# Altium schematic sheet LT3094.SchDoc: Almazny
size 420 x 297 mm; CompanyName: WUT; DrawnBy: S.Hanasz; Organization: WUT ISE; Address1: Warsaw Univeristy of Technology; Address2: Nowowiejska 15/19; SheetNumber: 4; SheetTotal: 4; EDA_Number: ARTIQ; Projet: ARTIQ/SINARA; ModifiedBy: -; CreateDate: 15.10.2020; CheckedDate: -; Title2: LT3094 negative LDO; DivGrp: ISE; Designer: S.Hanasz; ModifiedDate: -; ProjectName: ARTIQ/SINARA
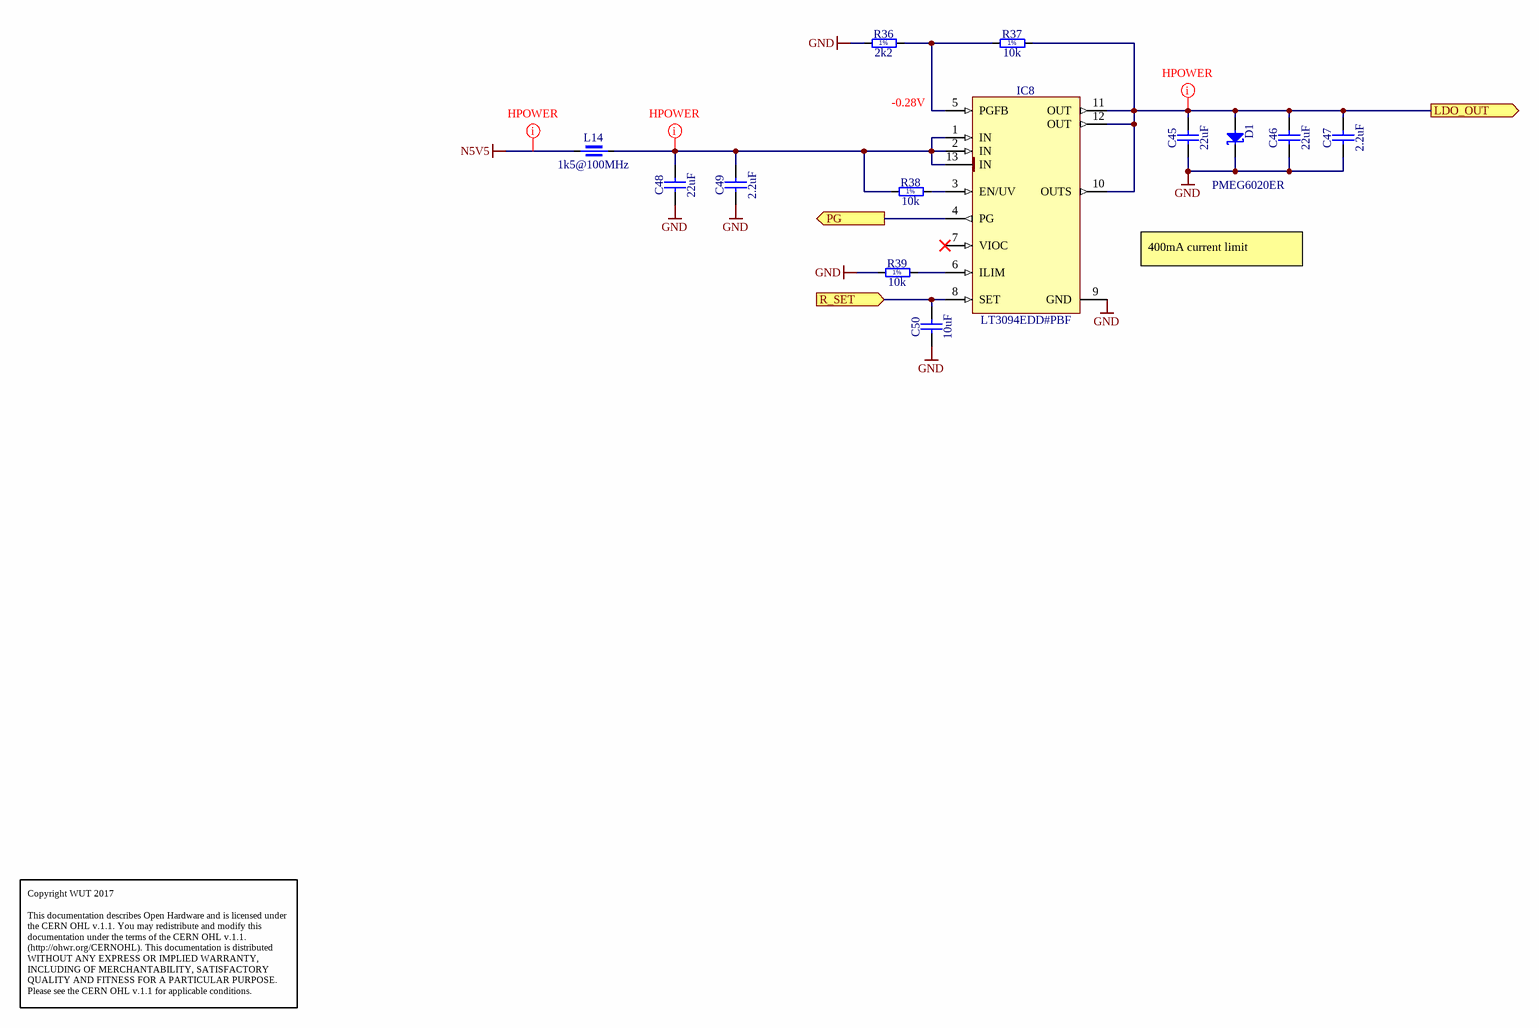
[diagram p0: LT3094.SchDoc]

## Parts
C45  22uF  [CAPC3225X140N]
C46  22uF  [CAPC3225X140N]
C47  2.2uF  [CAPC1608X87N]
C48  22uF  [CAPC3225X140N]
C49  2.2uF  [CAPC1608X87N]
C50  10uF  [CAPC2012X135N]
D1  PMEG6020ER  [SODFL3517X110N]
IC8  LT3094EDD#PBF  [SON45P300X300X80-13N-R175X248]
L14  1k5@100MHz  [INDC2012X110N]
R36  2k2  [RESC1005X40N]
R37  10k  [RESC1005X40N]
R38  10k  [RESC1005X40N]
R39  10k  [RESC1005X40N]

## Ports
LDO_OUT (out), PG (out), R_SET (in)

## Nets
GND: C45.1 C46.1 C47.1 C48.1 C49.1 C50.1 D1.1(C) IC8.9(GND) R36.1 R39.1
N5V5: L14.1
LDO_OUT: C45.2 C46.2 C47.2 D1.2(A) IC8.10(OUTS) IC8.11(OUT) IC8.12(OUT) R37.2 ; port LDO_OUT
PG: IC8.4(PG) ; port PG
R_SET: C50.2 IC8.8(SET) ; port R_SET
NetC48_2: C48.2 C49.2 IC8.1(IN) IC8.2(IN) IC8.13(IN) L14.2 R38.1
NetIC8_3: IC8.3(EN/UV) R38.2
NetIC8_5: IC8.5(PGFB) R36.2 R37.1
NetIC8_6: IC8.6(ILIM) R39.2

Not connected (* = marked no-connect by the designer): IC8 7(VIOC)*

## Layout directives
net class Hpower: LDO_OUT, N5V5, NetC48_2

## Notes on the sheet
- -0.28V
- 400mA current limit
- Copyright WUT 2017
  This documentation describes Open Hardware and is licensed under the CERN OHL v.1.1. You may redistribute and modify this documentation under the terms of the CERN OHL v.1.1. (http://ohwr.org/CERNOHL). This documentation is distributed WITHOUT ANY EXPRESS OR IMPLIED WARRANTY, INCLUDING OF MERCHANTABILITY, SATISFACTORY QUALITY AND FITNESS FOR A PARTICULAR PURPOSE. Please see the CERN OHL v.1.1 for applicable conditions.
- Project/Equipment
- Document
- Designer
- Drawn by
- Check.by
- File
- Last Mod.
- Print Date
- Sheet
- Size
- A3
- of
- Rev
- (in symbol R0402_2K2_1%_0.0625W_100PPM) 1%
- (in symbol R0402_10k_1%_0.0625W_100PPM) 1%
- (in symbol R0402_10K_1%_0.0625W_100PPM) 1%

## Library data of the parts
C45 C46 C48 = CC1210_22UF_25V_20%_X7R: Non-polarised capacitor; Part Description: SMD Multilayer Chip Ceramic Capacitor; Manufacturer: GENERIC; Manufacturer1 Part Number: C1210C226M3RACTU; Voltage: 25V; TC: X7R; Tolerance: ±20%; Part Number: CC1210_22UF_25V_20%_X7R; Component Kind: Standard; Component Type: Standard; Pin Count: 2; Value: 22uF; Status: None; Manufacturer Part Number: CC1210_22UF_25V_20%_X7R; Case: 1210; Mounted: Yes; Socket: No; SMD: Yes; Sense: No; Manufacturer1 Example: KEMET; Manufacturer1 ComponentHeight: 1.4mm; HelpURL: \\cern.ch\dfs\Applications\Altium\Datasheets\CC1210_X7R_KEMET.pdf; Author: CERN DEM JLC; CreateDate: 20.02.2018; LatestRevisionDate: 20.02.2018
C47 C49 = CC0603_2.2UF_16V_10%_X5R: Non-polarised capacitor; Part Description: SMD Multilayer Chip Ceramic Capacitor; Manufacturer: GENERIC; Manufacturer1 Part Number: CC0603KRX5R7BB225; Voltage: 16V; TC: X5R; Tolerance: ±10%; Part Number: CC0603_2.2UF_16V_10%_X5R; Component Kind: Standard; Component Type: Standard; Pin Count: 2; Value: 2.2uF; Status: Preferred; Manufacturer Part Number: CC0603_2.2UF_16V_10%_X5R; Case: 0603; Mounted: Yes; Socket: No; SMD: Yes; Sense: No; Manufacturer1 Example: YAGEO; Manufacturer1 ComponentHeight: 0.9mm; HelpURL: \\cern.ch\dfs\Applications\Altium\Datasheets\CC0805_X5R_PHYCOMP_HC.pdf; Author: CERN DEM JLC; CreateDate: 28.04.2011; LatestRevisionDate: 28.04.2011
C50 = CC0805_10UF_10V_10%_X7R: Non-polarised capacitor; Part Description: SMD Multilayer Chip Ceramic Capacitor; Manufacturer: GENERIC; Manufacturer1 Part Number: GRM21BR71A106KE51L; Voltage: 10V; TC: X7R; Tolerance: ±10%; Part Number: CC0805_10UF_10V_10%_X7R; Component Kind: Standard; Component Type: Standard; Pin Count: 2; Value: 10uF; Status: Preferred; Manufacturer Part Number: CC0805_10UF_10V_10%_X7R; Case: 0805; Mounted: Yes; Socket: No; SMD: Yes; Sense: No; Manufacturer1 Example: MURATA; Manufacturer1 ComponentHeight: 1.35mm; HelpURL: \\cern.ch\dfs\Applications\Altium\Datasheets\CC0805_X7R_MURATA.pdf; Author: CERN DEM JLC; CreateDate: 30.04.2012; LatestRevisionDate: 30.04.2012
D1 = PMEG6020ER: Schottky Diode; Part Description: MEGA Schottky Barrier Rectifier; Manufacturer: NXP SEMICONDUCTORS; Voltage: 60V; Power: 2A; PressFit: No; Bonding: No; Part Number: PMEG6020ER; Component Kind: Standard; Component Type: Standard; Device: PMEG6020ER; PackageDescription: SODFL Diode (SOD123W); 2.60mm W X 1.70mm L X 1.10mm H body, IPC Medium Density; Manufacturer Part Number: PMEG6020ER; Pin Count: 2; Case: SOD123; Mounted: Yes; Socket: No; SMD: Yes; Sense: No; ComponentHeight: 0.65mm; HelpURL: \\cern.ch\dfs\Applications\Altium\Datasheets\PMEG6020ER.pdf; Author: CERN DEM JMW; CreateDate: 19.06.2014; LatestRevisionDate: 19.06.2014
IC8 = LT3094EDD#PBF: -20V, 500mA, Ultralow Noise, Ultrahigh PSRR Negative Linear Regulator; Manufacturer: LINEAR TECHNOLOGY; PressFit: No; Bonding: No; Part Number: LT3094EDD#PBF; Component Kind: Standard; Component Type: Standard; Device: LT3094EDD#PBF; PackageDescription: SON, 0.45mm Pitch; 12 Pin, 3.00mm W X 3.00mm L X 0.80mm H Body (w/Thermal tab 1.75 x 2.48mm), IPC Medium Density; Part Description: -20V, 500mA, Ultralow Noise, Ultrahigh PSRR Negative Linear Regulator; Manufacturer Part Number: LT3094EDD#PBF; Pin Count: 13; Case: SON12; Mounted: Yes; Socket: No; SMD: Yes; Sense: No; ComponentHeight: 0.8mm; HelpURL: \\cern.ch\dfs\Applications\Altium\Datasheets\LT3094EDD#PBF.pdf; Author: CERN DEM JLC; CreateDate: 12.11.2018; LatestRevisionDate: 12.11.2018
L14 = IND0805_WURTH_742792097: Part Description: SMD EMI Suppression Chip Ferrite Bead (WE-CBF Series); Manufacturer: WURTH ELEKTRONIK; Power: 1A; Resistance: 0.3R; Tolerance: ±25%; Part Number: IND0805_WURTH_742792097; Component Kind: Standard; Component Type: Standard; Pin Count: 2; Value: 1k5@100MHz; Status: None; Manufacturer Part Number: 742792097; Case: 0805; Mounted: Yes; Socket: No; SMD: Yes; Sense: No; ComponentHeight: 1.1mm; HelpURL: \\cern.ch\dfs\Applications\Altium\Datasheets\IND0805_WURTH_742792097.pdf; Author: CERN DEM MR; CreateDate: 29.06.2017; LatestRevisionDate: 25.10.2018
R36 = R0402_2K2_1%_0.0625W_100PPM: Resistor - 1%; Part Description: General Purpose Thick Film Chip Resistor; Manufacturer: GENERIC; Manufacturer1 Part Number: 232270672202L; TC: ±100ppm/°C; PressFit: No; Part Number: R0402_2K2_1%_0.0625W_100PPM; Component Kind: Standard; Component Type: Standard; Pin Count: 2; Value: 2k2; Status: Not Recommended; Power: 0.0625W; Tolerance: ±1%; Manufacturer Part Number: R0402_2K2_1%_0.0625W_100PPM; Case: 0402; Mounted: Yes; Sense: No; Socket: No; SMD: Yes; Manufacturer1 Example: YAGEO PHYCOMP; Manufacturer1 ComponentHeight: 0.4mm; HelpURL: \\cern.ch\dfs\Applications\Altium\Datasheets\R0402_Phycomp_RC0402.pdf; Author: CERN DEM JLC; CreateDate: 03.12.2007; LatestRevisionDate: 17.10.2012
R37 R38 = R0402_10K_1%_0.0625W_100PPM: Resistor - 1%; Part Description: General Purpose Thick Film Chip Resistor; Manufacturer: GENERIC; Manufacturer1 Part Number: 232270671003L; TC: ±100ppm/°C; PressFit: No; Part Number: R0402_10K_1%_0.0625W_100PPM; Component Kind: Standard; Component Type: Standard; Pin Count: 2; Value: 10k; Status: Not Recommended; Power: 0.0625W; Tolerance: ±1%; Manufacturer Part Number: R0402_10K_1%_0.0625W_100PPM; Case: 0402; Mounted: Yes; Sense: No; Socket: No; SMD: Yes; Manufacturer1 Example: YAGEO PHYCOMP; Manufacturer1 ComponentHeight: 0.4mm; HelpURL: \\cern.ch\dfs\Applications\Altium\Datasheets\R0402_Phycomp_RC0402.pdf; Author: CERN DEM JLC; CreateDate: 03.12.2007; LatestRevisionDate: 17.10.2012
R39 = R0402_10k_1%_0.0625W_100PPM: Resistor - 1%; Part Description: General Purpose Thick Film Chip Resistor; Manufacturer: GENERIC; Manufacturer1 Part Number: 232270671003L; TC: ±100ppm/°C; PressFit: No; Part Number: R0402_10K_1%_0.0625W_100PPM; Component Kind: Standard; Component Type: Standard; Pin Count: 2; Value: 10k; Status: Not Recommended; Power: 0.0625W; Tolerance: ±1%; Manufacturer Part Number: R0402_10K_1%_0.0625W_100PPM; Case: 0402; Mounted: Yes; Sense: No; Socket: No; SMD: Yes; Manufacturer1 Example: YAGEO PHYCOMP; Manufacturer1 ComponentHeight: 0.4mm; HelpURL: \\cern.ch\dfs\Applications\Altium\Datasheets\R0402_Phycomp_RC0402.pdf; Author: CERN DEM JLC; CreateDate: 03.12.2007; LatestRevisionDate: 17.10.2012